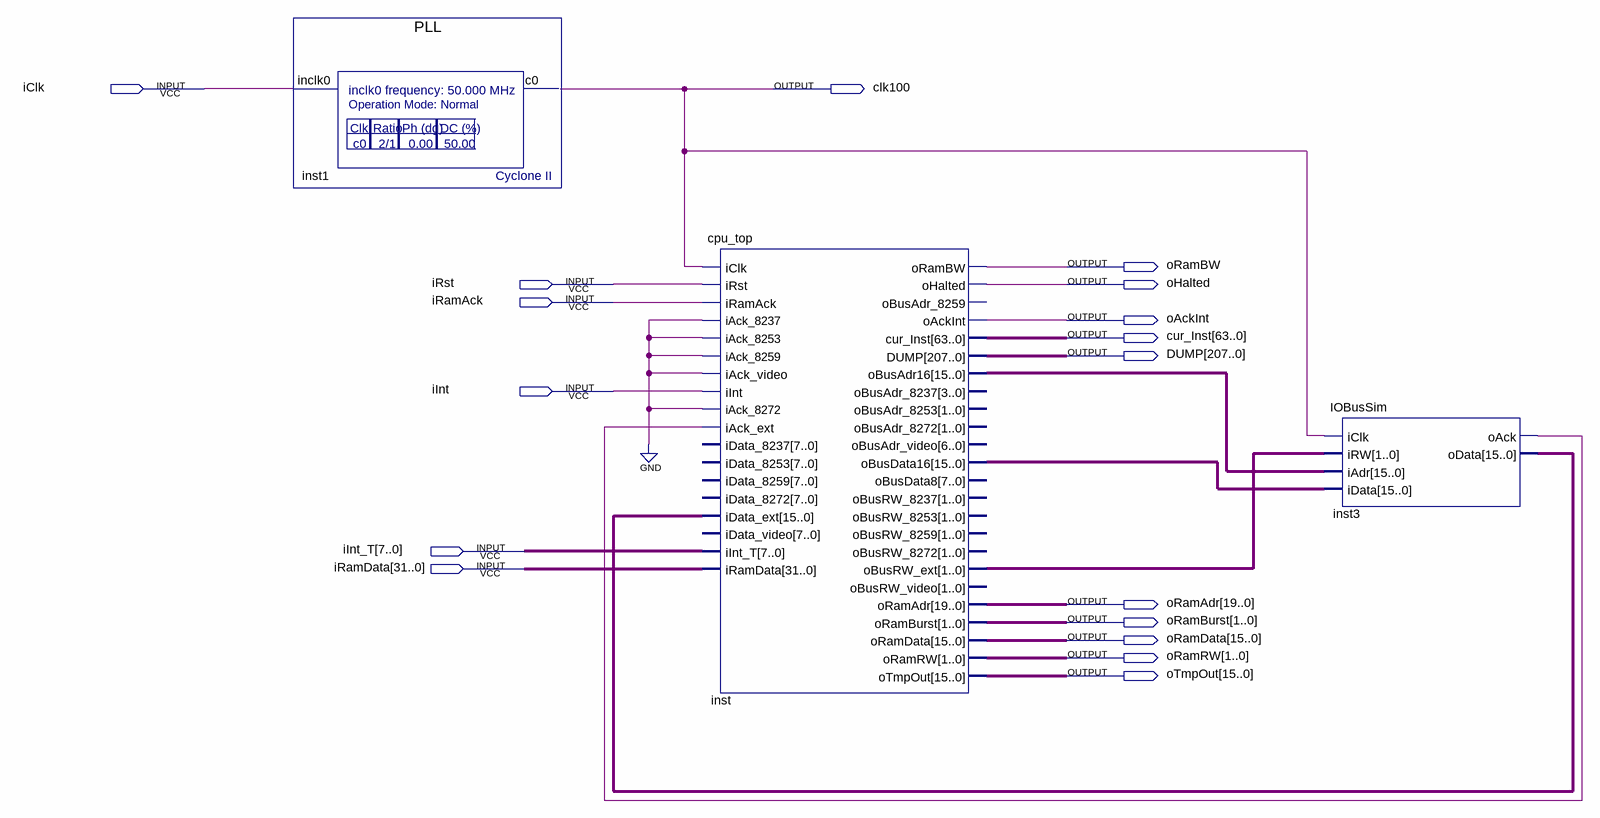
[diagram p0: schematic sheet]
// Quartus schematic OSOC86_cpu.bdf as structural Verilog: 3 symbols, 17 pins
module OSOC86_cpu (
  input  iClk,
  input  iRst,
  input  iRamAck,
  input  iInt,
  input  [7:0] iInt_T,
  input  [31:0] iRamData,
  output clk100,
  output oRamBW,
  output oHalted,
  output oAckInt,
  output [63:0] cur_Inst,
  output [207:0] DUMP,
  output [19:0] oRamAdr,
  output [1:0] oRamBurst,
  output [15:0] oRamData,
  output [1:0] oRamRW,
  output [15:0] oTmpOut
);

  wire inst3_oack;
  wire [1:0] inst_obusrw_ext;
  wire [15:0] inst3_odata, inst_obusadr16, inst_obusdata16;

  PLL inst1 (.inclk0(iClk), .c0(clk100));
  cpu_top inst (
    .iClk(clk100), .iRst(iRst), .iRamAck(iRamAck), .iAck_8237(1'b0), .iAck_8253(1'b0), .iAck_8259(1'b0),
    .iAck_video(1'b0), .iInt(iInt), .iAck_8272(1'b0), .iAck_ext(inst3_oack), .iData_ext(inst3_odata),
    .iInt_T(iInt_T), .iRamData(iRamData), .oRamBW(oRamBW), .oHalted(oHalted), .oAckInt(oAckInt),
    .cur_Inst(cur_Inst), .DUMP(DUMP), .oBusAdr16(inst_obusadr16), .oBusData16(inst_obusdata16),
    .oBusRW_ext(inst_obusrw_ext), .oRamAdr(oRamAdr), .oRamBurst(oRamBurst), .oRamData(oRamData),
    .oRamRW(oRamRW), .oTmpOut(oTmpOut));  // open: iData_8237, iData_8253, iData_8259, iData_8272, iData_video, oBusAdr_8259, oBusAdr_8237, oBusAdr_8253, oBusAdr_8272, oBusAdr_video, oBusData8, oBusRW_8237, oBusRW_8253, oBusRW_8259, oBusRW_8272, oBusRW_video
  IOBusSim inst3 (
    .iClk(clk100), .iRW(inst_obusrw_ext), .iAdr(inst_obusadr16), .iData(inst_obusdata16), .oAck(inst3_oack),
    .oData(inst3_odata));
endmodule
